# Altium schematic sheet LED_RGB_SMDx8.SCHDOC: Visual Indicators Top
size A4; DocumentNumber: 10; SheetNumber: 11; SheetTotal: 78
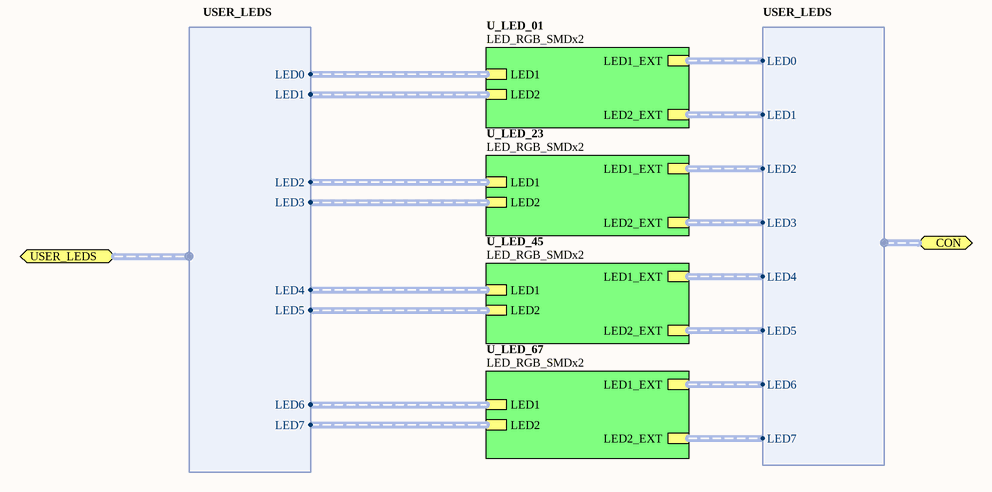
[diagram p0: LED_RGB_SMDx8.SCHDOC]

## Sub-sheets
U_LED_01 = LED_RGB_SMDx2: LED1 (harness RGB_LED), LED2 (harness RGB_LED), LED1_EXT (harness RGB_LED), LED2_EXT (harness RGB_LED)
U_LED_23 = LED_RGB_SMDx2: LED1 (harness RGB_LED), LED2 (harness RGB_LED), LED1_EXT (harness RGB_LED), LED2_EXT (harness RGB_LED)
U_LED_45 = LED_RGB_SMDx2: LED1 (harness RGB_LED), LED2 (harness RGB_LED), LED1_EXT (harness RGB_LED), LED2_EXT (harness RGB_LED)
U_LED_67 = LED_RGB_SMDx2: LED1 (harness RGB_LED), LED2 (harness RGB_LED), LED1_EXT (harness RGB_LED), LED2_EXT (harness RGB_LED)

## Ports
CON (harness USER_LEDS), USER_LEDS (harness USER_LEDS)

## Harnesses
USER_LEDS: LED0, LED1, LED2, LED3, LED4, LED5, LED6, LED7

## Notes on the sheet
- Sheet Title
- Project Title
- Size:
- Date:
- A4
- Assy:
- Time:
- Revision:
- Sheet
- of
- File: